# EAGLE design iMote (EAGLE 6.4)
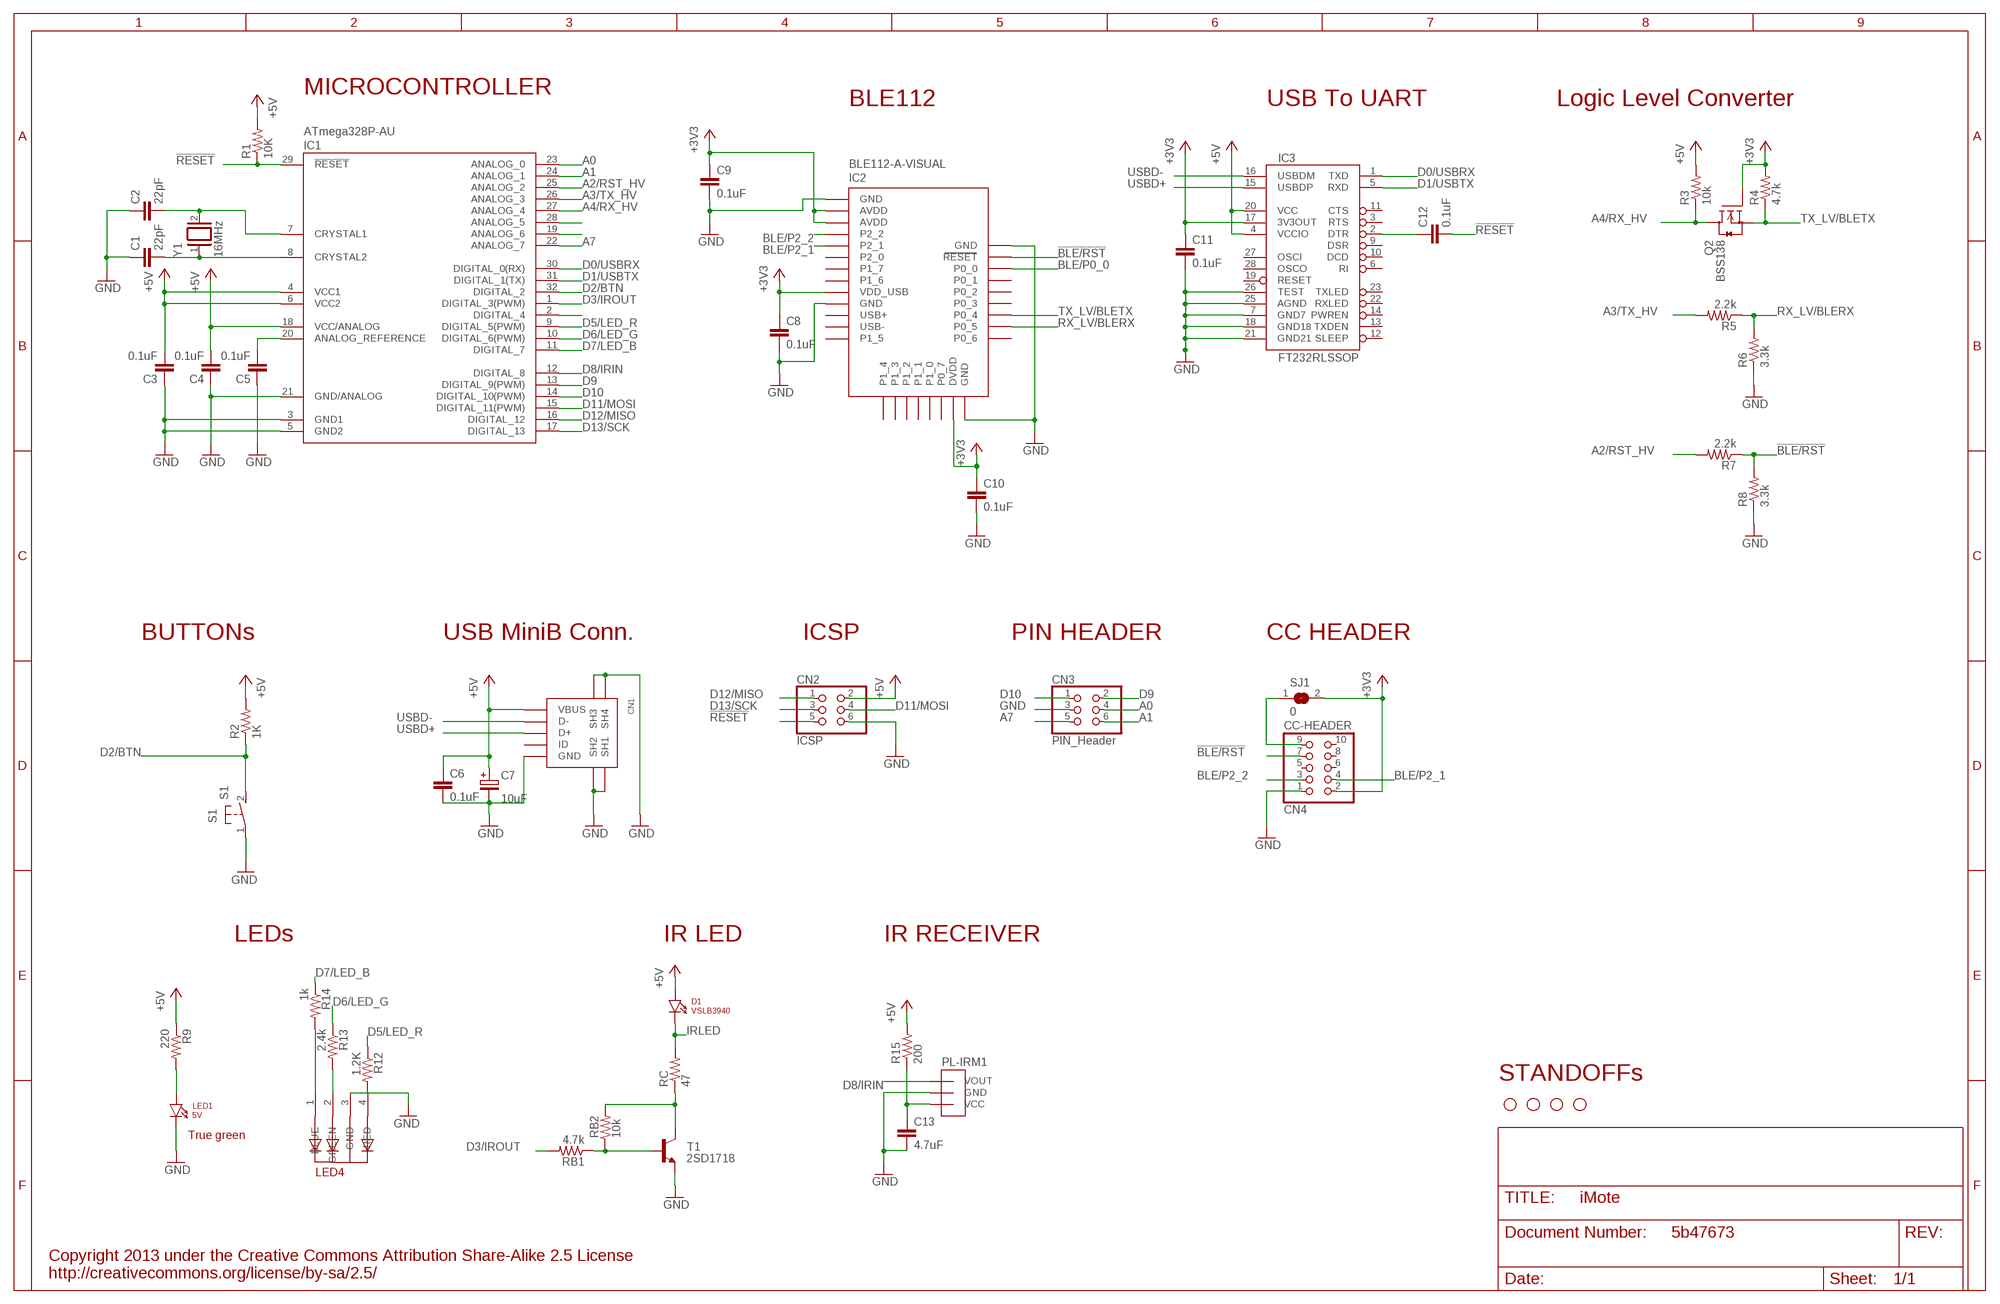
[diagram p0: schematic, sheet 1]

## Parts
C1  22pF  C-2012  [2012]
C2  22pF  C-2012  [2012]
C3  0.1uF  C-2012  [2012]
C4  0.1uF  C-2012  [2012]
C5  0.1uF  C-2012  [2012]
C6  0.1uF  C-2012  [2012]
C7  10uF  CPOL  [E2-5]
C8  0.1uF  C-2012  [2012]
C9  0.1uF  C-2012  [2012]
C10  0.1uF  C-2012  [2012]
C11  0.1uF  C-2012  [2012]
C12  0.1uF  C-2012  [2012]
C13  4.7uF  C-2012  [2012]
CN1  USB-MINIB-UX60SC-MB  [USB-MINIB-UX60SC-MB]
CN2  ICSP  PINHD-2X3  [2X03]
CN3  PIN_Header  PINHD-2X3  [2X03]
CN4  CC-HEADER  PINHD-2X5  [2X05]
D1  VSLB3940  LED-3MM  [LED-3MM]
IC1  ATmega328P-AU  ATMEGA168-AU  [TQFP32-08]
IC2  BLE112-A-VISUAL  [BLE112-A]
IC3  FT232RLSSOP  [SSOP28DB]
LED1  5V  LED-2012  [LED-2012]
LED4  5MMRGBLED  [LED5MMRGB]
PL-IRM1  PL-IRM2161  [IR-RECEIVER]
Q2  BSS138  [SOT23]
R1  10K  R  [2012]
R2  1K  R  [2012]
R3  10k  R  [2012]
R4  4.7k  R  [2012]
R5  2.2k  R  [2012]
R6  3.3k  R  [2012]
R7  2.2k  R  [2012]
R8  3.3k  R  [2012]
R9  220  R  [2012]
R12  1.2K  R  [2012]
R13  2.4k  R  [2012]
R14  1k  R  [2012]
R15  200  R  [2012]
RB1  4.7k  R  [2012]
RB2  10k  R  [2012]
RC  47  R  [2012]
S1  S1  31-XX  [B3F-31XX]
SJ1  0  SJ  [SJ]
STANDOFF1  STAND-OFF  [STAND-OFF]
STANDOFF2  STAND-OFF  [STAND-OFF]
STANDOFF3  STAND-OFF  [STAND-OFF]
STANDOFF4  STAND-OFF  [STAND-OFF]
T1  2SD1718  MMUN2211LT1-NPN-SC59-BEC  [SC59-BEC]
U$1  5b47673  GIT-REVISION  [GIT-REVISION]
Y1  16MHz  XTAL-HC-49/S  [XTAL-HC-49/S]

## Nets
!BLE/RST: CN4.7 IC2.RESET R7.1 R8.2
!RESET: C12.2 CN2.5 IC1.29(!RESET) R1.1
+3V3 [3.3v]: C8.1 C9.1 C10.1 C11.1 CN4.2 IC2.AVDD IC2.AVDD@2(AVDD) IC2.DVDD IC2.VDD_USB IC3.17(3V3OUT) Q2.1(G) R4.2 SJ1.2
+5V [power]: C3.2 C4.2 C6.1 C7.+ CN1.VBUS CN2.2 D1.A IC1.4(VCC1) IC1.6(VCC2) IC1.18(VCC/ANALOG) IC3.4(VCCIO) IC3.20(VCC) R1.2 R2.2 R3.2 R9.1 R15.2
A0: CN3.4 IC1.23(ANALOG_0)
A1: CN3.6 IC1.24(ANALOG_1)
A2/RST_HV: IC1.25(ANALOG_2) R7.2
A3/TX_HV: IC1.26(ANALOG_3) R5.2
A4/RX_HV: IC1.27(ANALOG_4) Q2.3(D) R3.1
A7: CN3.5 IC1.22(ANALOG_7)
AREF: C5.2 IC1.20(ANALOG_REFERENCE)
BLE/P0_0: IC2.P0_0
BLE/P2_1: CN4.4 IC2.P2_1
BLE/P2_2: CN4.3 IC2.P2_2
D0/USBRX: IC1.30(DIGITAL_0(RX)) IC3.1(TXD)
D1/USBTX: IC1.31(DIGITAL_1(TX)) IC3.5(RXD)
D2/BTN: IC1.32(DIGITAL_2) R2.1 S1.2(S)
D3/IROUT: IC1.1(DIGITAL_3(PWM)) RB1.2
D5/LED_R: IC1.9(DIGITAL_5(PWM)) R12.1
D6/LED_G: IC1.10(DIGITAL_6(PWM)) R13.1
D7/LED_B: IC1.11(DIGITAL_7) R14.1
D8/IRIN: IC1.12(DIGITAL_8) PL-IRM1.1(VOUT)
D9: CN3.2 IC1.13(DIGITAL_9(PWM))
D10: CN3.1 IC1.14(DIGITAL_10(PWM))
D11/MOSI: CN2.4 IC1.15(DIGITAL_11(PWM))
D12/MISO: CN2.1 IC1.16(DIGITAL_12)
D13/SCK: CN2.3 IC1.17(DIGITAL_13)
GND [gnd]: C1.1 C2.1 C3.1 C4.1 C5.1 C6.2 C7.- C8.2 C9.2 C10.2 C11.2 C13.2 CN1.GND CN1.S$1(SH1) CN1.S$1@2(SH3) CN1.S$1@3(SH3) CN1.S$2(SH2) CN1.S$2@2(SH4) CN1.S$2@3(SH4) CN2.6 CN3.3 CN4.1 IC1.3(GND1) IC1.5(GND2) IC1.21(GND/ANALOG) IC2.GND IC2.GND@2(GND) IC2.GND@3(GND) IC2.GND@4(GND) IC3.7(GND7) IC3.18(GND18) IC3.21(GND21) IC3.25(AGND) IC3.26(TEST) LED1.C LED4.3(GND) PL-IRM1.2(GND) R6.1 R8.1 S1.1(P) T1.E
IRLED [ir-power]: D1.C RC.2
N$1: C1.2 IC1.8(CRYSTAL2) Y1.1
N$2: C2.2 IC1.7(CRYSTAL1) Y1.2
N$3: LED1.A R9.2
N$4: IC1.28(ANALOG_5)
N$5: LED4.4(RED) R12.2
N$6: IC1.19(ANALOG_6)
N$8: C12.1 IC3.2(DTR)
N$10: RB1.1 RB2.1 T1.B
N$11 [ir-power]: RB2.2 RC.1 T1.C
N$14: IC1.2(DIGITAL_4)
N$15: LED4.2(GREEN) R13.2
N$16: C13.1 PL-IRM1.3(VCC) R15.1
N$17: LED4.1(BLUE) R14.2
PRG/VDD: CN4.9 SJ1.1
RX_LV/BLERX: IC2.P0_5 R5.1 R6.2
TX_LV/BLETX: IC2.P0_4 Q2.2(S) R4.1
USBD+: CN1.D+ IC3.15(USBDP)
USBD-: CN1.D- IC3.16(USBDM)
Unconnected: CN1.ID CN4.5 CN4.6 CN4.8 CN4.10 IC2.P0_1 IC2.P0_2 IC2.P0_3 IC2.P0_6 IC2.P0_7 IC2.P1_0 IC2.P1_1 IC2.P1_2 IC2.P1_3 IC2.P1_4 IC2.P1_5 IC2.P1_6 IC2.P1_7 IC2.P2_0 IC2.USB+ IC2.USB- IC3.3(RTS) IC3.6(RI) IC3.9(DSR) IC3.10(DCD) IC3.11(CTS) IC3.12(SLEEP) IC3.13(TXDEN) IC3.14(PWREN) IC3.19(RESET) IC3.22(RXLED) IC3.23(TXLED) IC3.27(OSCI) IC3.28(OSCO)

## Notes on the sheet
- MICROCONTROLLER
- BLE112 | USB To UART | Logic Level Converter
- BUTTONs | USB MiniB Conn. | ICSP | PIN HEADER | CC HEADER
- LEDs | IR LED | IR RECEIVER
- STANDOFFs
- True green
- Copyright 2013 under the Creative Commons Attribution Share-Alike 2.5 License
  http://creativecommons.org/license/by-sa/2.5/

## Library data of the parts
C1-C6 C8-C13 = my:C: CAPACITOR, European symbol
C7 = my:CPOL
CN1 = my:USB-MINIB: USB-MiniB 基板取付用ＵＳＢコネクタ・ミニＢ
CN2 CN3 = pinhead:PINHD-2X3: PIN HEADER
CN4 = pinhead:PINHD-2X5: PIN HEADER
D1 LED1 = my:LED: Through-hole LED
IC1 = my:ATMEGA168
IC2 = my:BLE112-A-VISUAL: Bluetooth Low Energy single-mode module - Bluetooth 4.0, chip antenna
IC3 = my:FT232RL: USB UART FT232RL 4th Generation USB UART (USB <-> Serial) Controller. Spark Fun Electronics SKU : COM-00650 Production SKU IC-00870; PROD_ID: IC-00870
LED4 = adafruit:5MMRGBLED
PL-IRM1 = my:PL-IRM2161: PL-IRM2161-XD1 IR Receiver http://akizukidenshi.com/catalog/g/gI-06491/ http://akizukidenshi.com/download/ds/paralight/PL-IRM2161-XD1.pdf
Q2 = m-pad-2.1:BSS138: Fairchild Semiconductors BSS138 N-Channel Logic Level Enhancement Mode Field Effect Transistor General Description: These N-Channel enhancement mode field effect transistors are produced using Fairchild's proprietary, high cell density, DMOS technology. These products have been designed to minimize on-state resistance while provide rugged, reliable, and fast switching performance.These products are particularly suited for low voltage, low current applications such as small servo motor control, power MOSFET gate drivers, and other switching applications. Features: 0.22 A, 50 V. RDS(ON) = 3.5Ohm @ VGS = 10 V RDS(ON) = 6.0Ohm @ VGS = 4.5 V High density cell design for extremely low RDS(ON) Rugged and Reliable Compact industry standard SOT-23 surface mount package Please send any comments to: messi@users.sourceforge.net
R1-R9 R12-R15 RB1 RB2 RC = my:R: RESISTOR
S1 = switch-omron:31-XX: OMRON SWITCH; MPN: B3F-3100; OC_FARNELL: 959704; OC_NEWARK: 36M3582
SJ1 = jumper:SJ: SMD solder JUMPER
STANDOFF1-STANDOFF4 = SparkFun-Electromechanical:STAND-OFF: #4 Stand Off This is the mechanical footprint for a #4 phillips button head screw. Use the keepout ring to avoid running the screw head into surrounding components. SKU : PRT-00447
T1 = transistor:*-NPN-: NPN Transistror BF959 corrected 2008.03.06
U$1 = git-revision:GIT-REVISION
Y1 = my:XTAL: CRYSTAL

## Net classes
0 default: width 0.254 mm
1 power: width 0.406 mm
2 ir-power: width 1.016 mm
3 gnd: width 0.406 mm
4 3.3v: width 0.406 mm

## Board
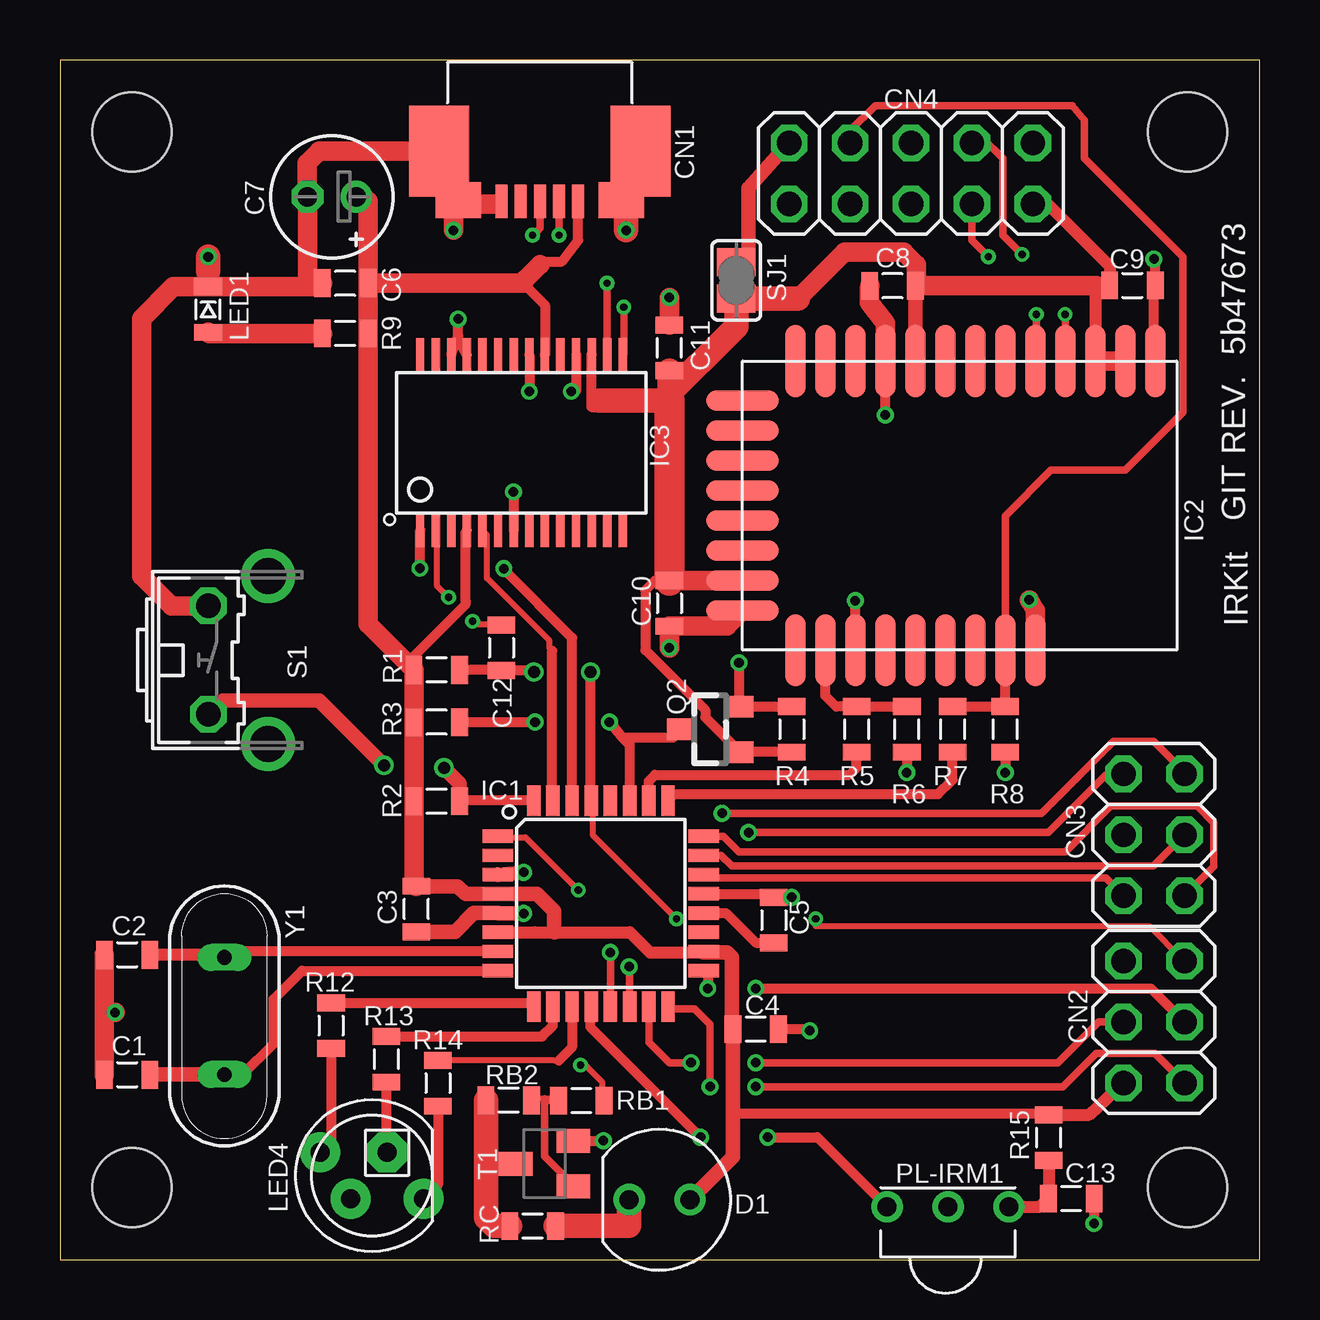
[diagram p1: board, top side]
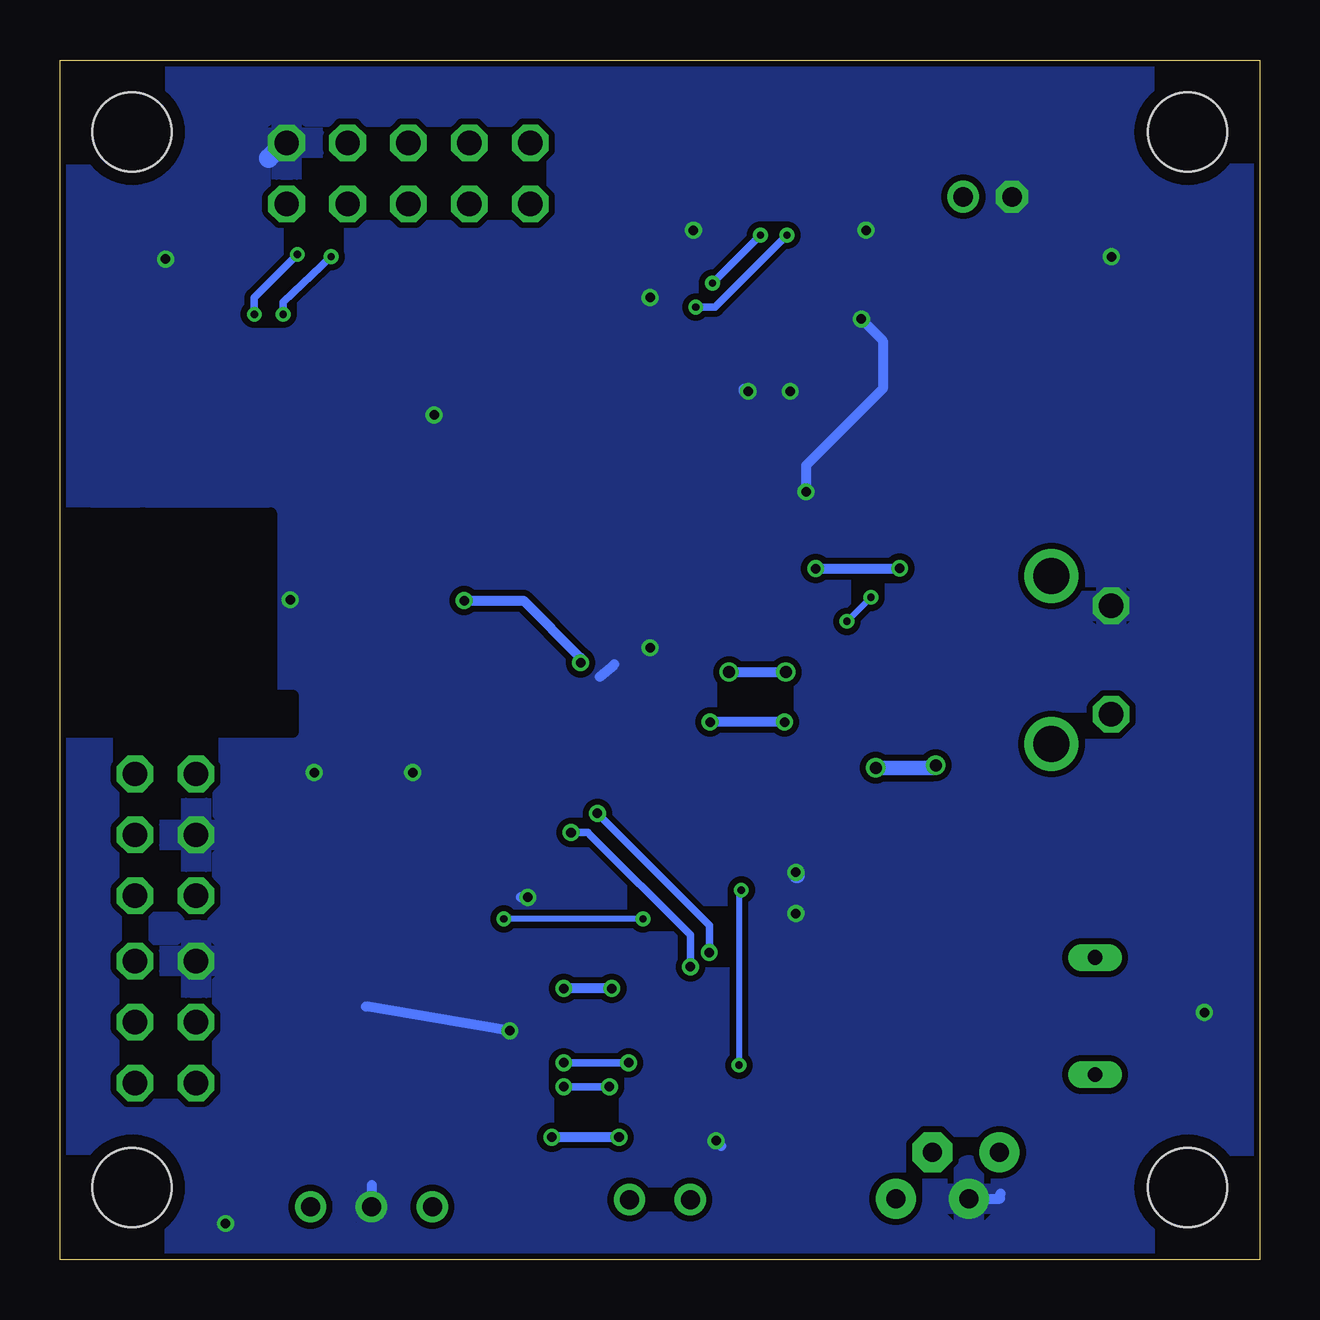
[diagram p2: board, bottom side, seen from below]

Size 50 x 50 mm. Coordinates in mm from the lower left corner, seen from the top.
Outline: 0,0 50,0 50,50 0,50 0,0
Copper layers (1*16): Top 0.035mm / dielectric 1.5mm / Bottom 0.035mm
Design rules "Fusion_eagle_rule_v1.1": minimum track width 6mil, minimum drill 12mil, track to track 6mil, track to pad 6mil, pad to pad 6mil, via to via 6mil, smd to smd 0mil, copper to edge 10mil, drill to drill 10mil, minimum pad ring 10mil, minimum via ring 6mil, stop-mask expansion 2mil, vias tented up to drill 100mil, thermal gap 10mil
bRestrict: area 40.3,22 to 48.8,23.5; area 46.6,23.6 to 48.8,31.1

### Footprints (pad centres in the part's own frame; a part is rotated, then mirrored left to right if it is on the bottom)
2012 = smd 0.7 x 1.15: 1 -0.95,0; 2 0.95,0
E2-5 = drill 0.813 pad 1.27: + -1.016,0 | drill 0.813 pad 1.27 octagon: - 1.016,0
USB-MINIB-UX60SC-MB = smd 0.5 x 1.4: D+ 0,5.8; D- -0.8,5.8; GND 1.6,5.8; ID 0.8,5.8; VBUS -1.6,5.8 | smd 1.4 x 4.7: S$1 -3.65,4.153; S$2 3.642,4.15 | smd 1.1 x 3.8: S$1@2 -4.9,3.703; S$2@2 4.892,3.701 | smd 0.5 x 1.5: S$1@3 -2.703,5.753; S$2@3 2.695,5.751
2X03 = drill 1.016 octagon: 1 -2.54,-1.27; 2 -2.54,1.27; 3 0,-1.27; 4 0,1.27; 5 2.54,-1.27; 6 2.54,1.27
2X05 = drill 1.016 octagon: 1 -5.08,-1.27; 2 -5.08,1.27; 3 -2.54,-1.27; 4 -2.54,1.27; 5 0,-1.27; 6 0,1.27; 7 2.54,-1.27; 8 2.54,1.27; 9 5.08,-1.27; 10 5.08,1.27
LED-3MM = drill 0.8: A -1.27,0; C 1.27,0
TQFP32-08 = smd 1.27 x 0.559: 1 -4.293,2.8; 2 -4.293,2; 3 -4.293,1.2; 4 -4.293,0.4; 5 -4.293,-0.4; 6 -4.293,-1.2; 7 -4.293,-2; 8 -4.293,-2.8; 17 4.293,-2.8; 18 4.293,-2; 19 4.293,-1.2; 20 4.293,-0.4; 21 4.293,0.4; 22 4.293,1.2; 23 4.293,2; 24 4.293,2.8 | smd 0.559 x 1.27: 9 -2.8,-4.293; 10 -2,-4.293; 11 -1.2,-4.293; 12 -0.4,-4.293; 13 0.4,-4.293; 14 1.2,-4.293; 15 2,-4.293; 16 2.8,-4.293; 25 2.8,4.293; 26 2,4.293; 27 1.2,4.293; 28 0.4,4.293; 29 -0.4,4.293; 30 -1.2,4.293; 31 -2,4.293; 32 -2.8,4.293
BLE112-A = smd 3 x 0.85: AVDD -6.05,6.9; AVDD@2 -6.05,5.65; GND -6.05,8.15; GND@2 -6.05,-3.1; GND@4 6,3.15; P0_0 6,0.65; P0_1 6,-0.6; P0_2 6,-1.85; P0_3 6,-3.1; P0_4 6,-4.35; P0_5 6,-5.6; P0_6 6,-6.85; P1_5 -6.05,-6.85; P1_6 -6.05,-0.6; P1_7 -6.05,0.65; P2_0 -6.05,1.9; P2_1 -6.05,3.15; P2_2 -6.05,4.4; RESET 6,1.9; USB+ -6.05,-4.35; USB- -6.05,-5.6; VDD_USB -6.05,-1.85 | smd 0.85 x 3: DVDD 3.1,-9.05; GND@3 4.35,-9.05; P0_7 1.85,-9.05; P1_0 0.6,-9.05; P1_1 -0.65,-9.05; P1_2 -1.9,-9.05; P1_3 -3.15,-9.05; P1_4 -4.4,-9.05
SSOP28DB = smd 0.348 x 1.397: 1 -4.225,-3.656; 2 -3.575,-3.656; 3 -2.925,-3.656; 4 -2.275,-3.656; 5 -1.625,-3.656; 6 -0.975,-3.656; 7 -0.325,-3.656; 8 0.325,-3.656; 9 0.975,-3.656; 10 1.625,-3.656; 11 2.275,-3.656; 12 2.925,-3.656; 13 3.575,-3.656; 14 4.225,-3.656; 15 4.225,3.656; 16 3.575,3.656; 17 2.925,3.656; 18 2.275,3.656; 19 1.625,3.656; 20 0.975,3.656; 21 0.325,3.656; 22 -0.325,3.656; 23 -0.975,3.656; 24 -1.625,3.656; 25 -2.275,3.656; 26 -2.925,3.656; 27 -3.575,3.656; 28 -4.225,3.656
LED-2012 = smd 0.7 x 1.15: A -0.95,0; C 0.95,0
LED5MMRGB = drill 0.8 pad 1.676: 1 -2.159,0.968; 3 0.889,0.968; 4 2.159,-0.968 | drill 0.8 pad 1.676 octagon: 2 -0.635,-0.968
IR-RECEIVER = drill 0.8: 1 -2.54,0; 2 0,0; 3 2.54,0
SOT23 = smd 0.9 x 1.2: 1 -0.95,-1.2; 2 0.95,-1.2; 3 0,1.2
B3F-31XX = drill 1.016 octagon: 1 -2.261,-1.245; 2 2.261,-1.245 | drill 1.499 pad 2.159: 3 -3.505,1.245; 4 3.505,1.245
SJ = smd 1.168 x 1.6: 1 -0.762,0; 2 0.762,0
STAND-OFF = hole 3.302: 0,0
SC59-BEC = smd 1 x 1.4: B -0.95,-1.2; C 0,1.2; E 0.95,-1.2
XTAL-HC-49/S = drill 0.61 long: 1 -2.44,0; 2 2.44,0

### Placement (x,y rotation side)
C1  2.8,7.7 0 top
C2  2.8,12.7 0 top
C3  14.85,14.61 90 top
C4  29,9.6 180 top
C5  29.75,14.15 270 top
C6  11.89,40.7 180 top
C7  11.34,44.3 180 top
C8  34.7,40.59 180 top
C9  44.7,40.6 0 top
C10  25.4,27.35 270 top
C11  25.4,38 90 top
C12  18.4,25.5 270 top
C13  42.15,2.55 0 top
CN1  20,49.9 180 top
CN2  45.6,9.9 90 top
CN3  45.6,17.7 270 top
CN4  35.47,45.27 180 top
D1  24.99,2.49 180 top
IC1  22.54,14.84 0 top
IC2  37.5,31.4 270 top
IC3  19.24,34.04 0 top
LED1  6.17,39.6 90 top
LED4  13,3.5 180 top
PL-IRM1  37.01,2.2 0 top
Q2  27.1,22.1 90 top
R1  15.7,24.57 180 top
R2  15.7,19.1 180 top
R3  15.7,22.4 180 top
R4  30.5,22.1 270 top
R5  33.2,22.1 270 top
R6  35.3,22.1 90 top
R7  37.2,22.1 270 top
R8  39.4,22.1 90 top
R9  11.89,38.6 180 top
R12  11.3,9.75 270 top
R13  13.6,8.35 270 top
R14  15.75,7.35 270 top
R15  41.21,5.08 90 top
RB1  21.73,6.63 0 top
RB2  18.7,6.64 180 top
RC  19.7,1.4 0 top
S1  7.42,24.99 270 top
SJ1  28.19,40.81 270 top
STANDOFF1  47,3 0 top
STANDOFF2  3,3 0 top
STANDOFF3  47,47 0 top
STANDOFF4  3,47 0 top
T1  20.2,4 90 top
U$1  49.4,30.8 90 top
Y1  6.85,10.15 90 top

### Tracks (layer width: path | path; a pad name or v marks a point on that pad's centre or on a via)
!BLE/RST
  Top 0.254: 39.4,25.2 IC2.RESET
  Top 0.305: 39.4,25.2 39.4,31 41.3,32.9 44.4,32.9 46.8,35.3 46.8,41.8 42.7,45.9 42.7,47.5 42.2,48.1 33.99,48.1 32.93,47.04 CN4.7 | IC2.RESET 39.6,25.1 | 39.5,25 IC2.RESET | 39.4,24.5 39.3,24.6 39.3,25 IC2.RESET
  Top 0.406: R7.1 R8.2 39.4,24.5
!RESET  (via drill 0.3, 0.5)
  Top 0.254: v25.7,14.2 22.2,17.7 22.2,19 IC1.29 | CN2.5 46.8,12.5 45.4,13.9 45.3,13.9 31.5,13.9 v31.5,14.2
  Top 0.406: IC1.29 22.11,19.16 v22.11,24.49 | v19.75,24.49 19.79,24.55 C12.2 18.38,24.57 R1.1
  Bottom 0.254: v31.5,14.2 27.1,14.2 v25.7,14.2
  Bottom 0.406: v22.11,24.49 v19.75,24.49
+3V3
  Top 0.406: IC2.AVDD 44.4,38.3 | 35.7,40.44 35.65,40.44 | R4.2 Q2.1 28.2,21.3 26.9,22.6 26.9,22.9 24.4,25.4 24.4,27.9 24.8,28.3 C10.1 | IC3.17 22.14,37.7 22.14,35.54 22.85,35.54 22.48,35.8
  Top 0.5: IC2.AVDD@2 43.15,40.35 43.2,40.6 C9.1 43.75,41.4 41.15,44 CN4.2
  Top 0.61: IC2.VDD_USB C8.1 35.7,40.39 35.7,40.44
  Top 0.813: 30.75,40.05 32.7,42 35.17,42 35.7,41.47 35.7,40.44 35.74,40.6 43.2,40.6 | IC2.AVDD@2 IC2.AVDD | IC2.DVDD C10.1
  Top 1.016: 25.1,35.8 25.4,35.8 C11.1 | 22.48,35.8 25.1,35.8 | 25.1,35.8 28.19,38.89 SJ1.2 30.75,40.05
  Top 1.27: 25.4,35.8 C10.1
+5V
  Top 0.406: IC3.20 20.21,39.79 19.41,40.59 | 21.61,43.99 CN1.VBUS 21.6,42.48 20.93,41.6 19.94,41.6 19.94,41.52 20,41.46 | 14.8,22.8 R3.2 | R15.2 41,6.1 28.3,6.1 28.05,6.1 | IC3.4 16.9,30.3 16.9,27.5 16.9,27.3 15.5,25.9 14.75,25.15 R1.2
  Top 0.5: IC1.6 19.8,13.64 20.61,13.64 23.76,13.64 24.6,12.8 26.79,12.8 IC1.18 | R15.2 42.9,6.03 CN2.2
  Top 0.61: 19.41,40.59 19.4,40.6 19.4,40.86 19.24,40.7 | 26.79,12.8 27.8,12.8 28,12.6 28,9.65 C4.2 28.05,6.1 28.05,4.28 D1.A | C3.2 16.57,15.56 16.9,15.24 IC1.4 19.88,15.24 20.6,14.53 20.6,13.65 20.61,13.64
  Top 0.813: 15.1,40.7 16.6,40.7 | 16.6,40.7 19.24,40.7 | 20,41.46 19.4,40.86 | C6.1 16.6,40.7 | C6.1 R9.1 12.84,28.38 12.84,26.49 R1.2 R3.2 R2.2 14.75,15.66 arc90 C3.2 | C6.1 12.89,40.74 12.84,40.74 | C7.+ 12.66,44.3 12.85,44.11 C6.1
A0
  Top 0.305: IC1.23 27.56,16.84 28,16.4 45.57,16.4 CN3.4
A1
  Top 0.305: IC1.24 27.66,17.64 28.3,17 41.9,17 43.8,18.9 47.4,18.9 48.1,18.2 48.1,16.39 CN3.6
A2/RST_HV
  Top 0.406: R7.2 37.2,20 36.6,19.4 25.6,19.4 25.34,19.14 IC1.25
A3/TX_HV
  Top 0.406: IC1.26 24.54,19.94 24.8,20.2 32.9,20.2 33.2,20.5 R5.2
A4/RX_HV  (via drill 0.4)
  Top 0.406: R3.1 v19.8,22.4 | v22.9,22.4 23.45,21.75 | 23.45,21.75 23.74,21.46 IC1.27 | Q2.3 25.55,21.75 23.45,21.75
  Bottom 0.406: v19.8,22.4 v22.9,22.4
A7
  Top 0.254: 26.9,16 IC1.22 | 44.3,15.2 CN3.5
  Top 0.305: 26.9,16 27,15.9 29.5,15.9 43.59,15.9 CN3.5
AREF
  Top 0.406: IC1.20 27.76,14.44 29,13.2 C5.2
BLE/P2_1  (via drill 0.3)
  Top 0.305: CN4.4 38.01,42.49 v38.7,41.8 | IC2.P2_1 40.7,37.2 v40.7,39.4
  Bottom 0.305: v40.7,39.4 40.7,39.9 v38.7,41.8
BLE/P2_2  (via drill 0.3)
  Top 0.305: CN4.3 38.46,46.74 39.3,45.9 39.3,42.7 v40.1,41.9 | IC2.P2_2 v41.9,39.4
  Bottom 0.305: v41.9,39.4 41.9,40.1 v40.1,41.9
D0/USBRX  (via drill 0.4)
  Top 0.406: IC1.30 21.35,19.14 21.35,25.91 18.5,28.76 v18.5,28.8 | v15,28.81 15.01,28.9 IC3.1
  Bottom 0.406: v18.5,28.8 18.49,28.81 v15,28.81
D1/USBTX
  Top 0.254: IC3.5 17.7,30.3 17.8,30.2 17.8,28.4 20.4,25.8 20.4,25.5 20.51,25.38
  Top 0.406: IC1.31 20.51,19.16 20.51,25.38
D2/BTN  (via drill 0.5)
  Top 0.406: IC1.32 16.68,19.14 R2.1
  Top 0.61: R2.1 16.65,19.85 v16,20.5 | v13.5,20.6 10.8,23.3 6.8,23.3 6.23,22.73 S1.2
  Bottom 0.61: v16,20.5 13.6,20.5 v13.5,20.6
D3/IROUT  (via drill 0.3)
  Top 0.254: v21.7,8.1 21.9,8.1 22.6,7.4 22.6,6.9 22.8,6.7 RB1.2 | v21.6,15.4 19.4,17.6 18.3,17.6 IC1.1
  Bottom 0.254: v21.7,8.1 21.7,15.4 v21.6,15.4
D5/LED_R
  Top 0.406: R12.1 19.59,10.7 IC1.9
D6/LED_G
  Top 0.406: R13.1 20.1,9.3 20.54,9.74 IC1.10 20.5,10.51
D7/LED_B
  Top 0.254: R14.1 15.8,8.3 20.6,8.3 20.8,8.3
  Top 0.406: IC1.11 21.34,8.84 20.8,8.3
D8/IRIN  (via drill 0.4)
  Top 0.406: IC1.12 22.1,10.55 22.1,9.7 v26.7,5.1 | v29.5,5.1 31.57,5.1 PL-IRM1.1
  Bottom 0.406: v26.7,5.1 v29.5,5.1
D9  (via drill 0.4)
  Top 0.305: IC1.13 v22.94,12.8 | v27.6,18.6 40.9,18.6 43.9,21.6 45.6,21.6 46.87,20.33 CN3.2
  Top 0.406: v22.94,12.8
  Bottom 0.305: v22.94,12.8 22.94,13.94 v27.6,18.6
D10  (via drill 0.4)
  Top 0.254: 44.3,20.2 CN3.1
  Top 0.305: IC1.14 23.74,12.28 | 44.3,20.2 43.6,20.2 41.2,17.8 v28.7,17.8
  Top 0.406: 23.74,12.28 v23.73,12.2
  Bottom 0.305: v23.73,12.2 23.73,13.53 27.9,17.7 28,17.8 v28.7,17.8
D11/MOSI  (via drill 0.4)
  Top 0.305: IC1.15 24.54,9.06 25.4,8.2 v26.3,8.2 | v29,8.2 41.6,8.2 43.3,9.9 CN2.4
  Bottom 0.305: v26.3,8.2 v29,8.2
D12/MISO  (via drill 0.4)
  Top 0.305: CN2.1 45.63,8.6 43.2,8.6 41.8,7.2 v29,7.2 | IC1.16 25.34,10.46 26.44,10.46 27.1,9.8 v27.1,7.2
  Bottom 0.305: v29,7.2 v27.1,7.2
D13/SCK  (via drill 0.4)
  Top 0.305: 26.93,11.94 IC1.17
  Top 0.406: 26.93,11.94 27,11.94 v27,11.3 | v29,11.3 45.47,11.3 CN2.3
  Bottom 0.406: v27,11.3 v29,11.3
GND  (via drill 0.4)
  Top 0.406: IC2.GND 45.6,37.2 45.6,40.3 C9.2 45.65,41.75 v45.6,41.7 | v34.4,35.2 IC2.GND@2 | 33.9,40.3 33.8,40.4 C8.2 | R6.1 v35.3,20.3 | R8.1 v39.4,20.3 | C13.2 v43.1,1.5 | T1.E v22.65,4.95 | IC3.26 16.57,38.41 | 16.57,38.41 16.6,38.5 v16.6,39.2 | v18.9,32 18.91,31.99 IC3.7 | IC3.25 16.57,38.41 | IC3.18 21.5,36.5 21.5,36.19 v21.31,36.19 | IC3.21 v19.56,36.19 | CN1.S$1@3 22.7,44.1 23.6,44.1 23.6,45.6 CN1.S$1 | 16.85,44.05 CN1.S$2@3 17.36,44 17.6,44 | CN1.GND 18.2,44 | C4.1 30,9.6 31.2,9.6 v31.25,9.54 | IC1.21 29.61,15.24 C5.1 v30.5,15.1
  Top 0.61: C3.1 16.46,13.66 17.24,14.44 IC1.5 arc90 IC1.5 v19.32,14.43 | IC1.3 arc90 IC1.3 v19.32,16.14
  Top 0.813: C11.2 25.4,39.4 v25.4,40.1 | IC2.GND@4 40.65,27.05 v40.4,27.5 | IC2.GND@2 34.4,39.03 33.74,39.89 33.74,40.48 C8.2 | C2.1 1.85,10.3 | 1.85,10.3 v2.3,10.3 | 1.85,10.3 C1.1 | v25.4,25.5 C10.2 27.8,26.4 IC2.GND@3 | CN1.S$1@2 24.1,46.1 CN1.S$1 | v16.4,42.9 16.4,43.6 | 16.4,43.6 16.4,45.61 CN1.S$2 15.91,46.1 15.61,46.14 | 15.61,46.14 CN1.S$2@2 10.8,46.2 10.3,45.7 10.3,44.32 C7.- 10.32,40.57 10.3,40.55 | 16.85,44.05 16.4,43.6 | 17.6,44 18.2,44 | 15.56,46.18 15.61,46.14 | S1.1 4.65,27.25 3.4,28.5 3.4,39.23 4.72,40.55 LED1.C | LED1.C 6.17,41.2 | LED1.C 10.3,40.55 | 10.3,40.55 10.79,40.55 C6.2
  Top 1.016: v6.17,41.8 6.17,41.2 | v23.6,42.9 23.6,44.1
  Bottom 0.406: 27.5,24.3 26.89,24.81 | LED4.3 10.82,2.53 10.8,2.75 | 22.6,4.95 v22.65,4.95 22.7,5 22.43,4.73 | v21.31,36.19 21.5,36.19 21.5,36.3 | PL-IRM1.2 37,3.1 | v16.6,39.2 15.7,38.3 15.7,36.3 18.9,33.1 v18.9,32 | v31.25,9.54 37.25,10.55 | v30.5,15.1 30.8,15.1
  Bottom 0.61: v19.32,16.14 arc90 19.26,16 19.3,16 | v19.32,14.43 arc90 19.36,14.4 19.3,14.4
  Bottom 0.813: CN4.1 40.55,46.65 41.3,45.9
  pour Bottom (isolate 0.254): 0,50 50,50 50,0 0,0
IRLED
  Top 1.016: RC.2 23.72,1.4 D1.C
N$1
  Top 0.406: IC1.8 10.09,12.04 8.9,10.85 8.9,9 7.61,7.71 Y1.1
  Top 0.61: Y1.1 3.76,7.71 C1.2
N$2
  Top 0.254: 7,12.7 Y1.2
  Top 0.406: IC1.7 7.1,12.84 Y1.2
  Top 0.5: 7,12.7 C2.2
N$3
  Top 0.813: R9.2 6.22,38.6 LED1.A
N$5
  Top 0.406: R12.2 11.3,4.93 LED4.4
N$8  (via drill 0.3)
  Top 0.254: v17.2,26.6 17.2,26.5 18.4,26.5 C12.1 | v16.2,27.6 15.7,28.1 15.7,30.3 IC3.2
  Bottom 0.254: v16.2,27.6 v17.2,26.6
N$10
  Top 0.254: 20.4,6.7 20.7,6.7 RB1.1 | 20.4,6.7 20.2,6.7 19.7,6.7 RB2.1 | 21.4,3.1 T1.B | 20.4,6.6 20.4,6.7
  Top 0.305: 21.4,3.1 20.2,4.3 20.2,6.7
N$11
  Top 1.016: 17.75,4.1 17.75,1.75 18.1,1.4 RC.1 | T1.C 17.85,4 17.75,4.1 | 17.75,4.1 RB2.2
N$15
  Top 0.406: R13.2 13.6,4.93 LED4.2
N$16
  Top 0.5: PL-IRM1.3 40.85,2.2 C13.1 R15.1
N$17
  Top 0.406: R14.2 15.75,3.12 LED4.1
PRG/VDD
  Top 0.254: SJ1.1 28.2,41.6 28.4,41.8 28.4,41.9 28.7,42
  Top 0.61: CN4.9 28.7,44.65 28.7,42
RX_LV/BLERX
  Top 0.305: 35.5,22.85 R6.2
  Top 0.406: R6.2 R5.1 32.35,23.05 31.9,23.5 IC2.P0_5 32,25.1
TX_LV/BLETX  (via drill 0.4)
  Top 0.406: IC2.P0_4 v33.15,27.46 | v28.3,24.88 Q2.2 R4.1
  Bottom 0.406: v33.15,27.46 30.69,27.46 28.3,25.07 v28.3,24.88
USBD+  (via drill 0.3)
  Top 0.305: 23.56,39.66 v23.5,39.7 23.5,37.74 IC3.15 | v19.7,42.7 20,43 CN1.D+
  Bottom 0.305: v23.5,39.7 22.7,39.7 v19.7,42.7
USBD-  (via drill 0.3)
  Top 0.305: 22.8,37.51 IC3.16 | IC3.16 | CN1.D- v20.8,42.7 | v22.8,40.7 v22.81,40.69 IC3.16
  Bottom 0.305: v22.8,40.7 v20.8,42.7

### Text on the board
tNames: IRKit